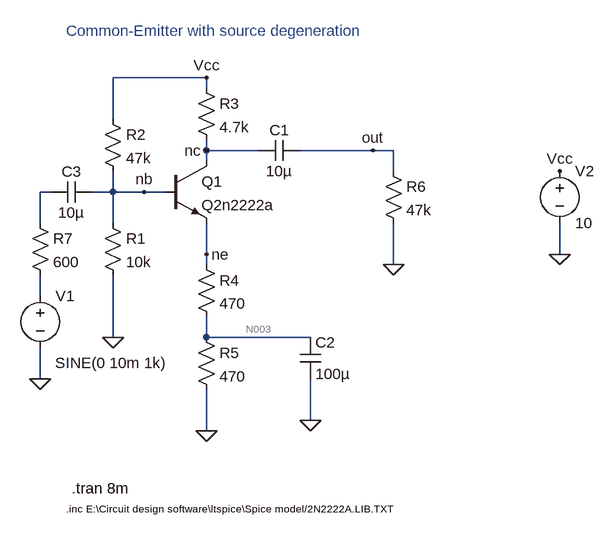
[diagram p0: schematic common_emitter_with_degeneration.asc]
common_emitter_with_degeneration.asc, the LTspice schematic file:
Version 4
SHEET 1 880 756
WIRE 160 80 16 80
WIRE 160 96 160 80
WIRE 16 144 16 80
WIRE 160 192 160 176
WIRE 240 192 160 192
WIRE 416 192 304 192
WIRE 448 192 416 192
WIRE 160 208 160 192
WIRE 448 224 448 192
WIRE -80 256 -96 256
WIRE 16 256 16 224
WIRE 16 256 -16 256
WIRE 64 256 16 256
WIRE 96 256 64 256
WIRE -96 304 -96 256
WIRE 16 304 16 256
WIRE 160 352 160 304
WIRE 704 352 704 304
WIRE 160 368 160 352
WIRE 448 368 448 304
WIRE -96 416 -96 384
WIRE 16 480 16 384
WIRE 160 480 160 448
WIRE 320 480 160 480
WIRE -96 544 -96 496
WIRE 320 608 320 544
WIRE 160 624 160 560
FLAG 64 256 nb
FLAG 160 192 nc
FLAG 160 352 ne
FLAG 160 624 0
FLAG 448 368 0
FLAG 16 480 0
FLAG -96 544 0
FLAG 320 608 0
FLAG 704 352 0
FLAG 704 224 Vcc
FLAG 160 80 Vcc
FLAG 416 192 out
SYMBOL npn3 96 208 R0
SYMATTR InstName Q1
SYMATTR Value Q2n2222a
SYMBOL res 0 288 R0
SYMATTR InstName R1
SYMATTR Value 10k
SYMBOL res 0 128 R0
SYMATTR InstName R2
SYMATTR Value 47k
SYMBOL res 144 80 R0
SYMATTR InstName R3
SYMATTR Value 4.7k
SYMBOL res 144 352 R0
SYMATTR InstName R4
SYMATTR Value 470
SYMBOL voltage -96 400 R0
WINDOW 123 0 0 Left 0
WINDOW 39 0 0 Left 0
WINDOW 3 23 119 Left 2
SYMATTR InstName V1
SYMATTR Value SINE(0 10m 1k)
SYMBOL res 144 464 R0
SYMATTR InstName R5
SYMATTR Value 470
SYMBOL cap 304 176 R90
WINDOW 0 0 32 VBottom 2
WINDOW 3 32 32 VTop 2
SYMATTR InstName C1
SYMATTR Value 10µ
SYMBOL res 432 208 R0
SYMATTR InstName R6
SYMATTR Value 47k
SYMBOL cap 304 480 R0
SYMATTR InstName C2
SYMATTR Value 100µ
SYMBOL cap -16 240 R90
WINDOW 0 0 32 VBottom 2
WINDOW 3 32 32 VTop 2
SYMATTR InstName C3
SYMATTR Value 10µ
SYMBOL res -112 288 R0
SYMATTR InstName R7
SYMATTR Value 600
SYMBOL voltage 704 208 R0
WINDOW 123 0 0 Left 0
WINDOW 39 0 0 Left 0
SYMATTR InstName V2
SYMATTR Value 10
TEXT -56 744 Left 1 !.inc E:\\Circuit design software\\ltspice\\Spice model/2N2222A.LIB.TXT
TEXT -48 712 Left 2 !.tran 8m
TEXT -56 8 Left 2 ;Common-Emitter with source degeneration

The netlist it stands for:
* common_emitter_with_degeneration.asc
Q1 nc nb ne 0 Q2n2222a
R1 nb 0 10k
R2 Vcc nb 47k
R3 Vcc nc 4.7k
R4 ne N003 470
V1 N002 0 SINE(0 10m 1k)
R5 N003 0 470
C1 out nc 10µ
R6 out 0 47k
C2 N003 0 100µ
C3 nb N001 10µ
R7 N001 N002 600
V2 Vcc 0 10
.model NPN NPN
.model PNP PNP
.lib standard.bjt
.inc E:\Circuit design software\ltspice\Spice model/2N2222A.LIB.TXT
.tran 8m
* Common-Emitter with source degeneration
.backanno
.end

* Results of the author's LTspice run, read from the files saved beside the schematic
* Operating Point, zero values left out:
*   V(nc) = 5.05 V
*   V(nb) = 1.681 V
*   V(ne) = 998.4 mV
*   V(vcc) = 10 V
*   V(n003) = 499.2 mV
*   Ic(Q1) = 1.053 mA
*   Ib(Q1) = 8.859 µA
*   Ie(Q1) = -1.062 mA
*   I(R5) = 1.062 mA
*   I(R4) = 1.062 mA
*   I(R3) = 1.053 mA
*   I(R2) = 177 µA
*   I(R1) = 168.1 µA
*   I(V2) = -1.23 mA
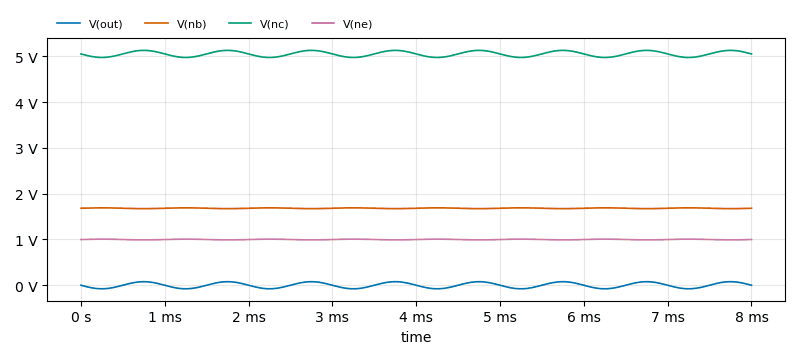
[diagram p1: Transient Analysis of common_emitter_with_degeneration.asc, plotted from the saved traces]
* Transient Analysis, 1 run:
*   V(out): min -77.34 mV, max 78.01 mV, average 349.7 µV, rms 54.91 mV, last -72.41 µV
*   V(nb): min 1.672 V, max 1.691 V, average 1.681 V, rms 1.681 V, last 1.681 V
*   V(nc): min 4.972 V, max 5.128 V, average 5.05 V, rms 5.05 V, last 5.05 V
*   V(ne): min 989.8 mV, max 1.007 V, average 998.4 mV, rms 998.4 mV, last 998.4 mV